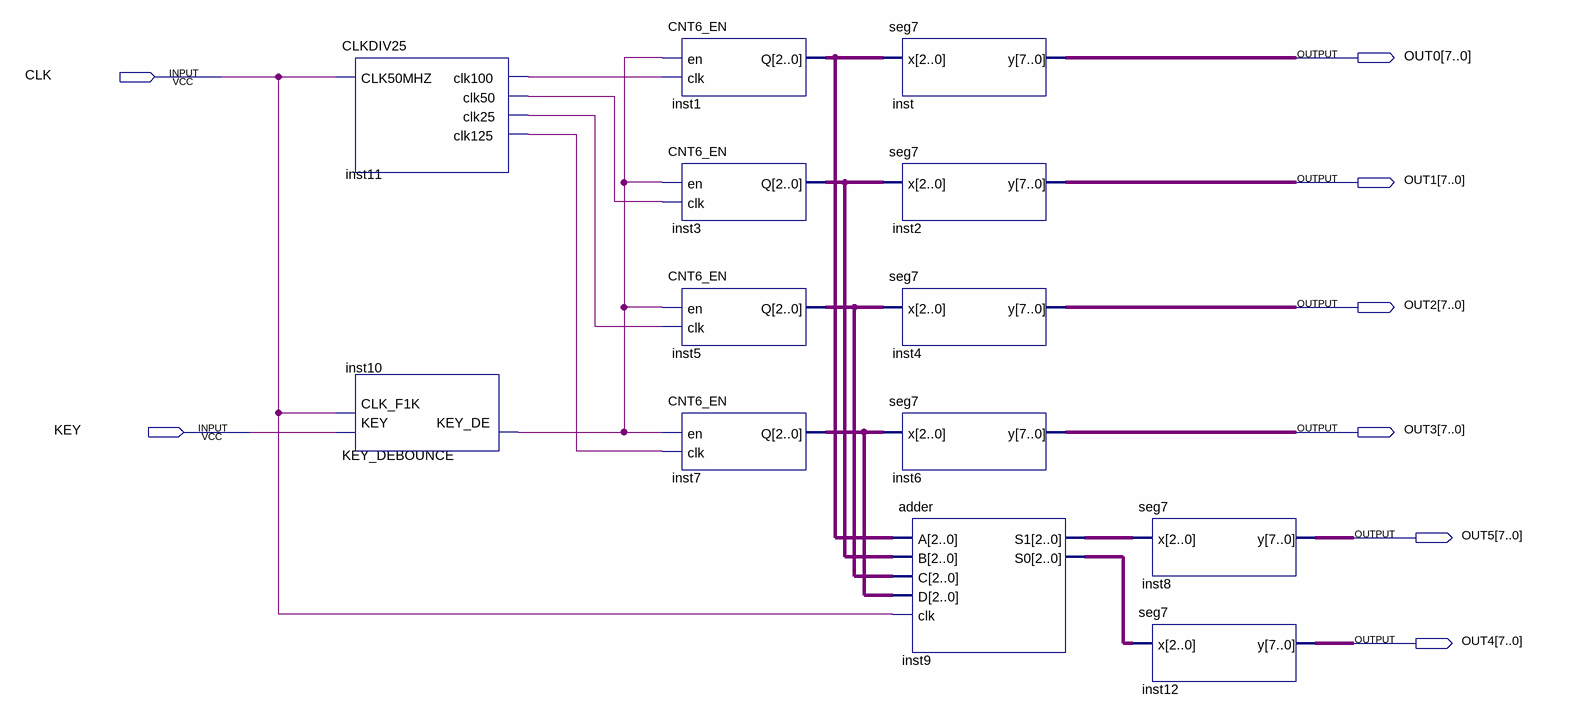
[diagram p0: schematic sheet]
// Quartus schematic final2.bdf as structural Verilog: 13 symbols, 8 pins
module final2 (
  input  CLK,
  input  KEY,
  output [7:0] OUT0,
  output [7:0] OUT1,
  output [7:0] OUT2,
  output [7:0] OUT3,
  output [7:0] OUT5,
  output [7:0] OUT4
);

  wire inst10_key_de, inst11_clk25, inst11_clk50, inst11_clk100, inst11_clk125;
  wire [2:0] inst1_q, inst3_q, inst5_q, inst7_q, inst9_s0, inst9_s1;

  CLKDIV25 inst11 (
    .CLK50MHZ(CLK), .clk100(inst11_clk100), .clk50(inst11_clk50), .clk25(inst11_clk25), .clk125(inst11_clk125));
  KEY_DEBOUNCE inst10 (.KEY(KEY), .CLK_F1K(CLK), .KEY_DE(inst10_key_de));
  CNT6_EN inst1 (.en(inst10_key_de), .clk(inst11_clk100), .Q(inst1_q));
  CNT6_EN inst3 (.en(inst10_key_de), .clk(inst11_clk50), .Q(inst3_q));
  CNT6_EN inst5 (.en(inst10_key_de), .clk(inst11_clk25), .Q(inst5_q));
  CNT6_EN inst7 (.en(inst10_key_de), .clk(inst11_clk125), .Q(inst7_q));
  seg7 inst (.x(inst1_q), .y(OUT0));
  seg7 inst2 (.x(inst3_q), .y(OUT1));
  seg7 inst4 (.x(inst5_q), .y(OUT2));
  seg7 inst6 (.x(inst7_q), .y(OUT3));
  adder inst9 (.A(inst1_q), .B(inst3_q), .C(inst5_q), .D(inst7_q), .clk(CLK), .S1(inst9_s1), .S0(inst9_s0));
  seg7 inst8 (.x(inst9_s1), .y(OUT5));
  seg7 inst12 (.x(inst9_s0), .y(OUT4));
endmodule
